# EAGLE design i2cLCD (EAGLE 6.1)
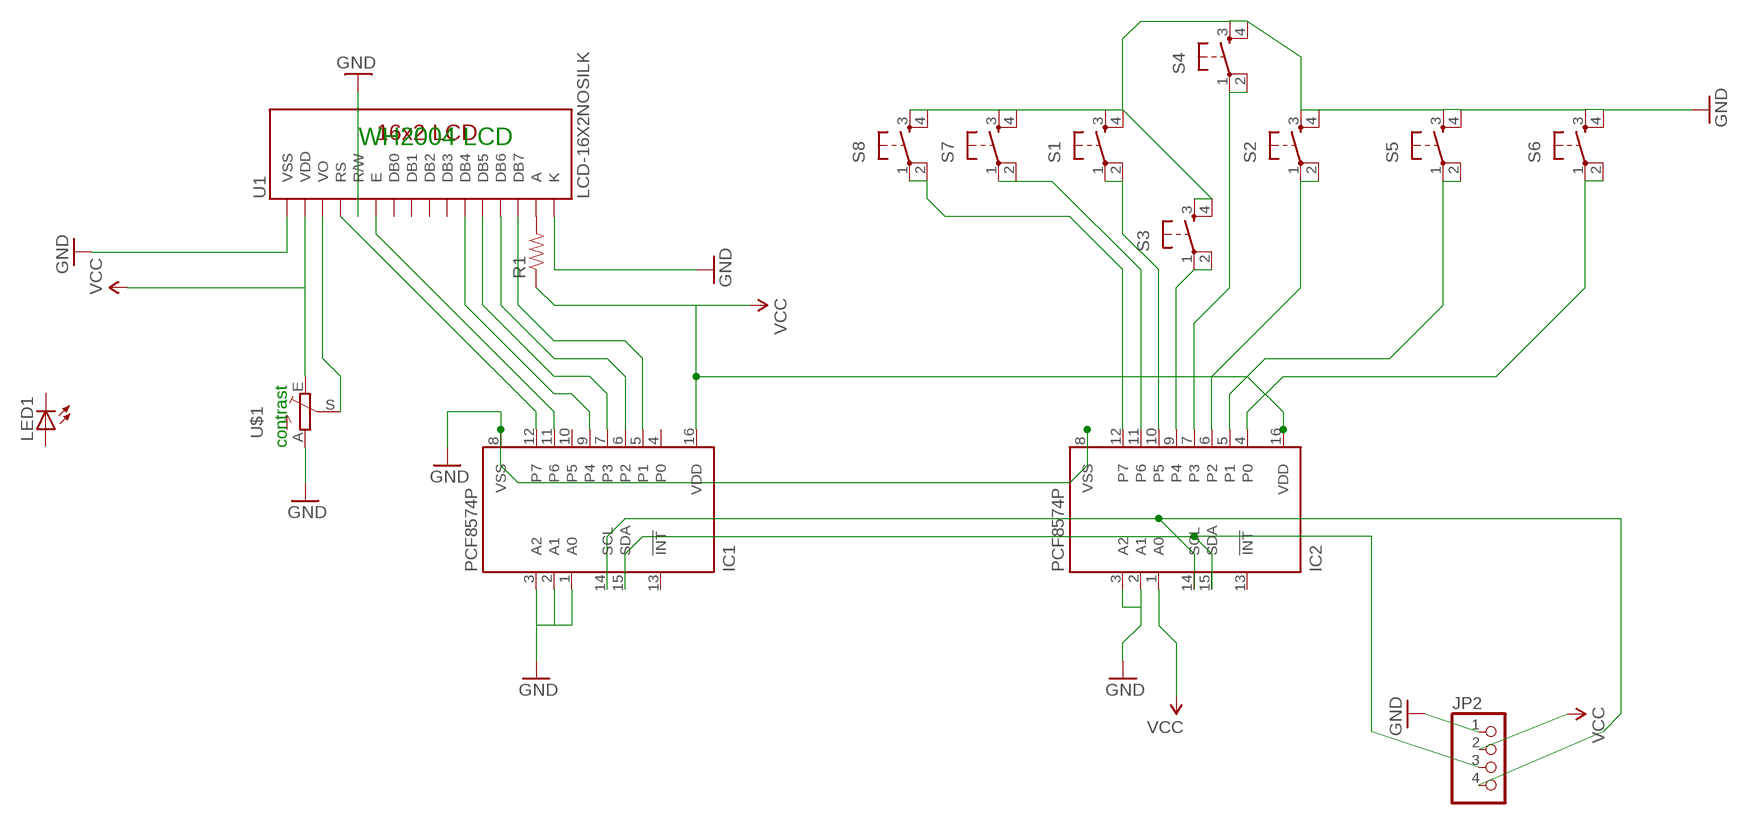
[diagram p0: schematic, sheet 1]

## Parts
IC1  PCF8574P  [DIL16]
IC2  PCF8574P  [DIL16]
JP2  PINHD-1X4/90  [1X04/90]
LED1  LED1206  [LED-1206]
R1  RESISTORPTH-1/4W  [AXIAL-0.4]
S1  TAC_SWITCHPTH  [TACTILE-PTH]
S2  TAC_SWITCHPTH  [TACTILE-PTH]
S3  TAC_SWITCHPTH  [TACTILE-PTH]
S4  TAC_SWITCHPTH  [TACTILE-PTH]
S5  TAC_SWITCHPTH  [TACTILE-PTH]
S6  TAC_SWITCHPTH  [TACTILE-PTH]
S7  TAC_SWITCHPTH  [TACTILE-PTH]
S8  TAC_SWITCHPTH  [TACTILE-PTH]
U1  LCD-16X2NOSILK  [LCD-16X2_NOSILK]
U$1  TRIM_EU-CA9V  [CA9V]

## Nets
N$1: U1.3(VO) U$1.S
N$2: R1.P$2 U1.15(A)
N$3: IC1.14(SCL) IC2.14(SCL) JP2.4
N$4: IC1.5(P1) U1.14(DB7)
N$5: IC1.6(P2) U1.13(DB6)
N$6: IC1.7(P3) U1.12(DB5)
N$7: IC1.9(P4) U1.11(DB4)
N$8: IC1.11(P6) U1.6(E)
N$9: IC1.12(P7) U1.4(RS)
N$10: IC1.15(SDA) IC2.15(SDA) JP2.3
N$13: IC2.10(P5) S1.1 S1.2
N$14: IC2.9(P4) S3.1 S3.2
N$15: IC2.7(P3) S4.1 S4.2
N$16: IC2.6(P2) S2.1 S2.2
N$17: IC2.5(P1) S5.1 S5.2
N$18: IC2.4(P0) S6.1 S6.2
N$19: IC2.11(P6) S7.1 S7.2
N$20: IC2.12(P7) S8.1 S8.2
N$31: IC1.1(A0) IC1.2(A1) IC1.3(A2) IC1.8(VSS) IC2.2(A1) IC2.3(A2) IC2.8(VSS) JP2.1 S1.3 S1.4 S2.3 S2.4 S3.3 S3.4 S4.3 S4.4 S5.3 S5.4 S6.3 S6.4 S7.3 S7.4 S8.3 S8.4 U1.1(VSS) U1.5(R/W) U1.16(K) U$1.A ; supply symbol labelled GND
VCC: IC1.16(VDD) IC2.1(A0) IC2.16(VDD) JP2.2 R1.P$1 U1.2(VDD) U$1.E
Unconnected: IC1.4(P0) IC1.10(P5) IC1.13(!INT) IC2.13(!INT) LED1.A LED1.C U1.7(DB0) U1.8(DB1) U1.9(DB2) U1.10(DB3)

## Notes on the sheet
- WH2004 LCD
- contrast

## Library data of the parts
IC1 IC2 = micro-philips:PCF8574: I2C-Bus Remote 8-bit I/O expander http://www.semiconductors.philips.com/acrobat_download/datasheets/PCF8574_4.pdf; MPN: PCF8574PN; OC_FARNELL: 204020; OC_NEWARK: 11N8515
JP2 = pinhead:PINHD-1X4: PIN HEADER
LED1 = LilyPad-Wearables:LED: LEDs Standard schematic elements and footprints for 5mm, 3mm, 1206, and 0603 sized LEDs. 5mm - Spark Fun Electronics SKU : Comp-SBL
R1 = SparkFun-Passives:RESISTOR: Resistor Basic schematic elements and footprints for 0603, 1206, and PTH resistors.
S1-S8 = SparkFun-Electromechanical:TAC_SWITCH: Momentary Switch Button commonly used for reset or general input. Spark Fun Electronics SKU : COM-00097
U1 = SparkFun-Displays:LCD-16X2: Standard text-only 16x2 parallel input LCD
U$1 = pot:TRIM_EU-: POTENTIOMETER

## Board
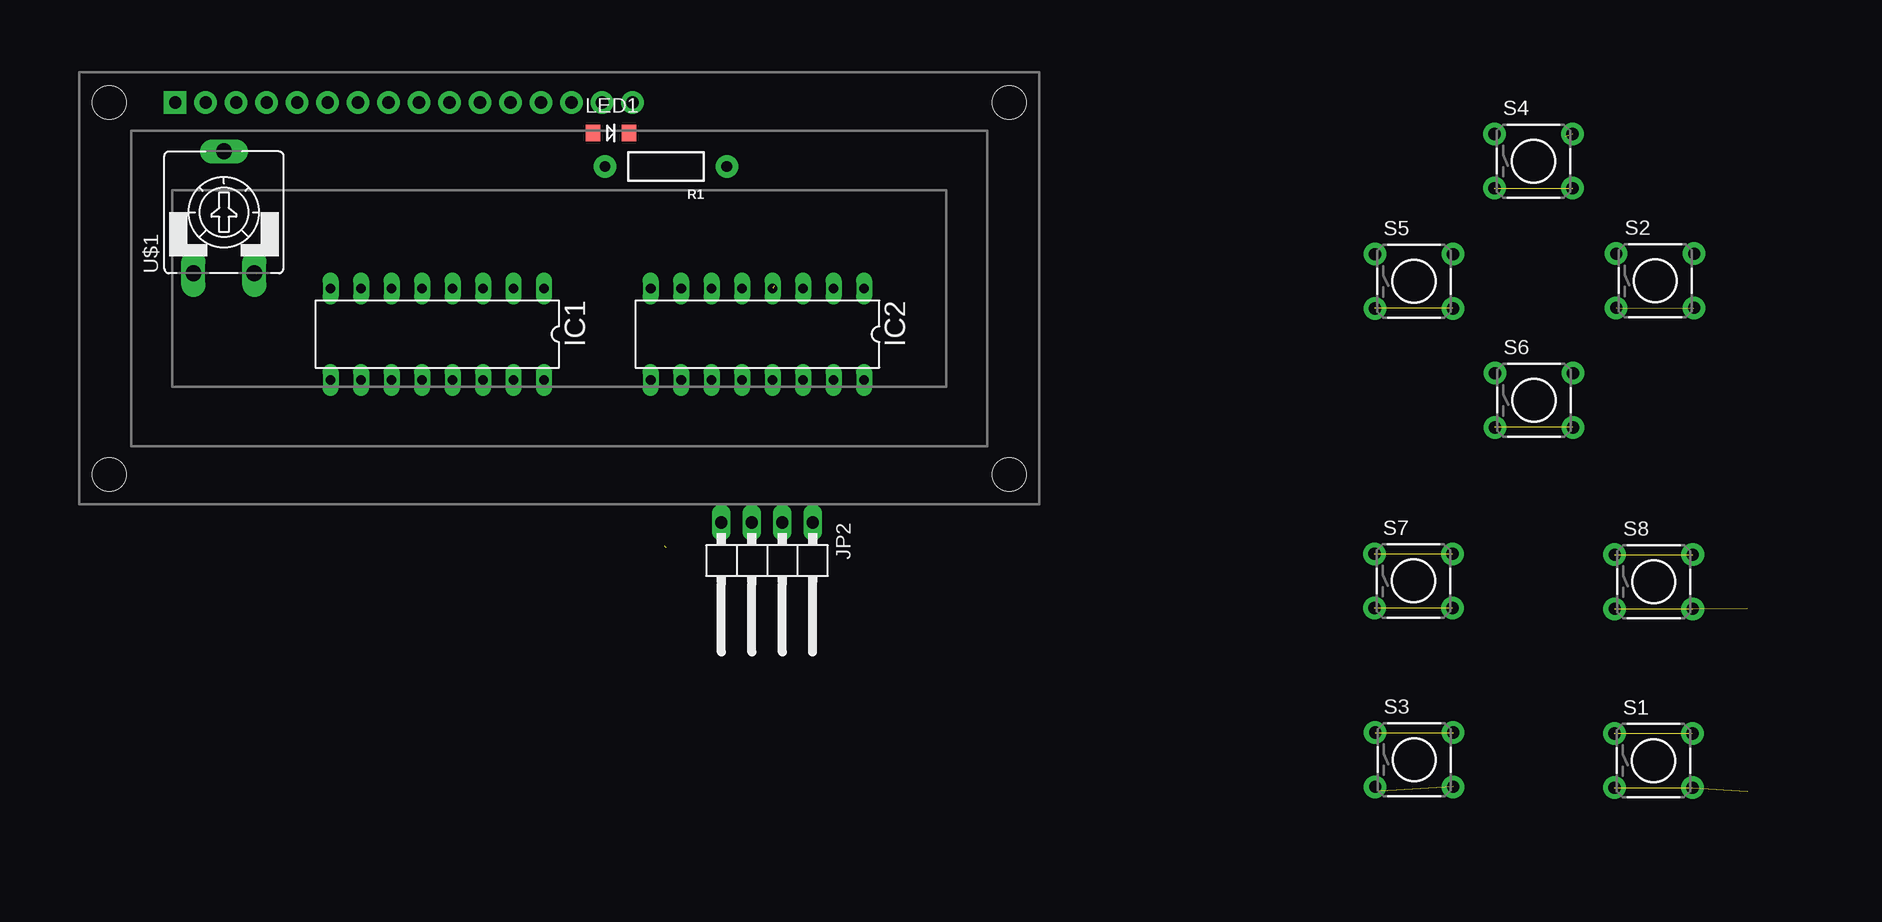
[diagram p1: board, top side]
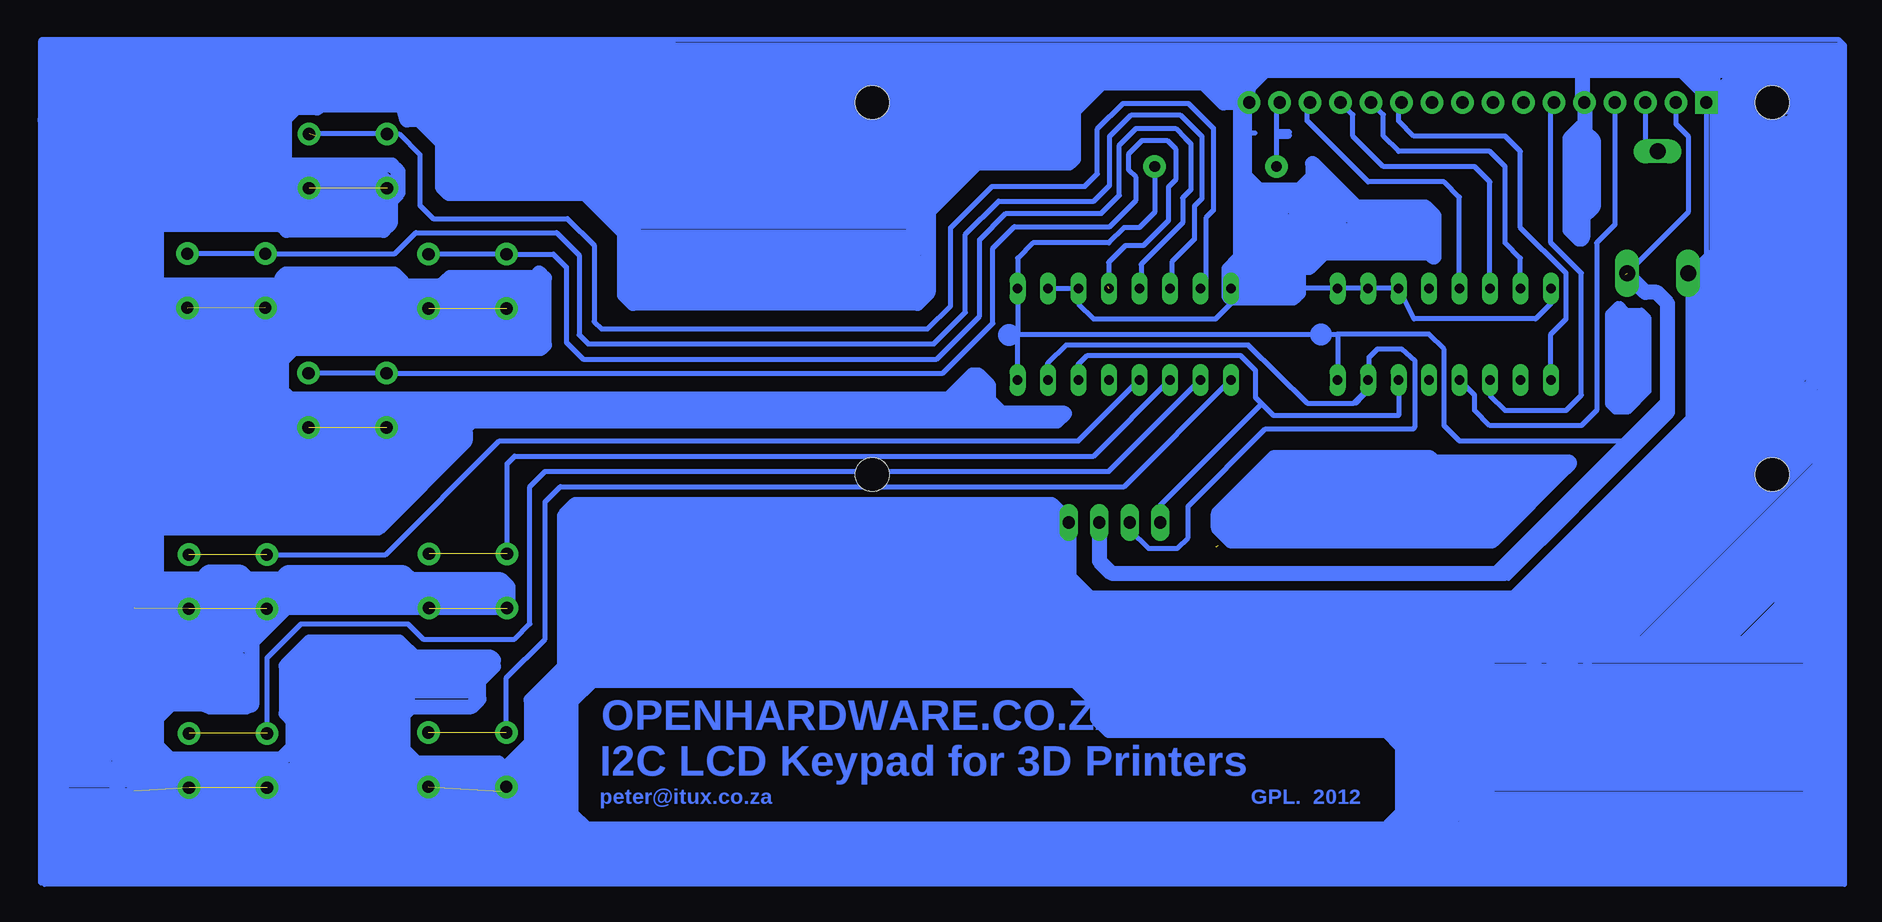
[diagram p2: board, bottom side, seen from below]

No outline drawn. Coordinates in mm, seen from the top.
Copper layers (1*16): Top 0.035mm / dielectric 1.5mm / Bottom 0.035mm
Design rules: minimum track width 10mil, minimum drill 24mil, track to track 8mil, track to pad 8mil, pad to pad 8mil, via to via 8mil, smd to smd 8mil, copper to edge 40mil, drill to drill 8mil, minimum pad ring 10mil, minimum via ring 8mil, stop-mask expansion 4mil, vias tented up to drill 0mil, thermal gap 10mil

### Footprints (pad centres in the part's own frame; a part is rotated, then mirrored left to right if it is on the bottom)
DIL16 = drill 0.813 long: 1 -8.89,-3.81; 2 -6.35,-3.81; 3 -3.81,-3.81; 4 -1.27,-3.81; 5 1.27,-3.81; 6 3.81,-3.81; 7 6.35,-3.81; 8 8.89,-3.81; 9 8.89,3.81; 10 6.35,3.81; 11 3.81,3.81; 12 1.27,3.81; 13 -1.27,3.81; 14 -3.81,3.81; 15 -6.35,3.81; 16 -8.89,3.81
1X04/90 = drill 1.016 long: 1 -3.81,-3.81; 2 -1.27,-3.81; 3 1.27,-3.81; 4 3.81,-3.81
LED-1206 = smd 1.2 x 1.4: A -1.5,0; C 1.5,0
AXIAL-0.4 = drill 0.9 pad 1.88: P$1 -5.08,0; P$2 5.08,0
TACTILE-PTH = drill 1.016 pad 1.88: 1 -3.251,2.261; 2 3.251,2.261; 3 -3.251,-2.261; 4 3.251,-2.261
LCD-16X2_NOSILK = drill 1.016 pad 1.88 square: 1 -32,15.5 | drill 1.016 pad 1.88: 2 -29.46,15.5; 3 -26.92,15.5; 4 -24.38,15.5; 5 -21.84,15.5; 6 -19.3,15.5; 7 -16.76,15.5; 8 -14.22,15.5; 9 -11.68,15.5; 10 -9.14,15.5; 11 -6.6,15.5; 12 -4.06,15.5; 13 -1.52,15.5; 14 1.02,15.5; 15 3.56,15.5; 16 6.1,15.5 | hole 2.8: -37.5,15.5; -37.5,-15.5; 37.5,15.5; 37.5,-15.5
CA9V = drill 1.321 long: A -2.54,-5.08; E 2.54,-5.08; S 0,5.08

### Placement (x,y rotation side)
IC1  31.75,40.64 180 top
IC2  58.42,40.64 180 top
JP2  59.23,21.13 180 top
LED1  46.21,57.41 0 top
R1  50.8,54.61 180 top
S1  133.1,5.11 0 top
S2  133.24,45.09 0 top
S3  113.16,5.18 0 top
S4  123.1,55.07 0 top
S5  113.14,45.05 0 top
S6  123.14,35.13 0 top
S7  113.1,20.08 0 top
S8  133.12,20.01 0 top
U1  41.91,44.45 0 top
U$1  13.97,50.8 0 top

### Tracks (layer width: path | path; a pad name or v marks a point on that pad's centre or on a via)
N$1
  Bottom 0.406: U1.3 14.99,56.9 U$1.S
N$2
  Bottom 0.406: R1.P$2 45.72,59.7 U1.15
N$3
  Bottom 0.406: IC1.14 35.56,33.88 45.99,33.88 46.95,34.83 | IC2.14 62.23,38.14 61.49,38.87 48.73,38.87 47.49,37.63 47.49,35.37 46.95,34.83 | JP2.4 55.41,24.95 55.41,26.37 46.95,34.83
N$4
  Bottom 0.406: IC1.5 30.48,52.07 31.75,53.34 38.1,53.34 43.18,58.42 43.18,59.7 U1.14
N$5
  Bottom 0.406: IC1.6 27.94,53.34 29.21,54.61 36.83,54.61 39.37,57.15 39.37,58.93 U1.13
N$6
  Bottom 0.406: IC1.7 25.4,46.99 26.67,48.26 26.67,54.61 27.94,55.88 35.56,55.88 36.83,57.15 36.83,58.93 U1.12
N$7
  Bottom 0.406: IC1.9 22.86,40.64 21.59,41.91 21.59,45.72 25.4,49.53 25.4,55.88 26.67,57.15 34.29,57.15 35.56,58.42 35.56,59.7 U1.11
N$8
  Bottom 0.406: IC1.11 27.94,35.56 26.67,34.29 21.59,34.29 20.32,35.56 20.32,45.72 22.86,48.26 22.86,59.7 U1.6
N$9
  Bottom 0.406: U1.4 17.53,49.78 19.05,48.26 19.05,34.29 20.32,33.02 27.94,33.02 29.21,34.29 29.21,35.56 IC1.12
N$10
  Bottom 0.406: IC1.15 38.1,36.03 39.11,34.9 39.28,34.9 | IC2.15 64.8,36.86 64.8,38.2 63.27,39.74 48.06,39.74 43.18,34.9 39.28,34.9 | 39.28,34.9 38,36.18 38,38.72 37.31,39.41 35.29,39.41 34.22,38.48 34.22,32.87 34.34,32.75 46.65,32.75 53.1,26.29 53.1,23.7 54.01,22.79 56.39,22.79 57.95,24.35 JP2.3
N$11
  Bottom 1.27: -0.25,59.93 -0.25,60.18 2.16,62.58 95.84,62.58 97.42,64.16 -0.58,64.16 -0.66,64.08 -0.66,-4.32 -0.5,-4.48 106.27,-4.48
N$12
  Bottom 1.27: -0.58,61.45 0.41,61.45 2.49,63.53
N$13  (1 unrouted)
  Bottom 0.406: S1.1 129.85,13.66 127,16.51 118.11,16.51 116.84,15.24 109.22,15.24 107.95,16.51 107.95,27.94 106.68,29.21 59.69,29.21 IC2.10
N$14  (1 unrouted)
  Bottom 0.406: S3.1 109.91,12.01 106.68,15.24 106.68,26.67 105.41,27.94 58.42,27.94 IC2.9
N$15  (1 unrouted)
  Bottom 0.406: 125.73,57.15 125.55,57.33 S4.1 118.84,57.33 117.11,55.6 117.11,51.38 116,50.27 104.81,50.27 102.6,48.06 102.6,41.7 101.98,41.07 74.83,41.07 72.89,43.01 72.89,49.51 69.44,52.97 61.7,52.97 60.66,54.01 60.66,57.74 58.52,59.88 53.06,59.88 50.99,57.81 50.99,50.96 51.61,50.34 51.61,44.91 IC2.7
N$16
  Bottom 0.406: S2.2 S2.1 119.2,47.35 117.45,49.1 105.71,49.1 103.84,47.23 103.84,40.59 103.08,39.83 74.27,39.83 71.65,42.46 71.65,48.96 68.88,51.72 60.94,51.72 59.62,53.04 59.62,57.12 57.83,58.91 53.75,58.91 51.96,57.12 51.96,51.93 52.58,51.31 52.58,48.54 54.44,46.68 54.44,44.62 IC2.6
N$17
  Bottom 0.406: 116.05,47.65 S5.2 S5.1 105.98,47.31 104.9,46.23 104.9,39.95 103.51,38.55 74.05,38.55 70.47,42.14 70.47,48.52 68.28,50.71 60.32,50.71 58.82,52.2 58.82,56.39 57.43,57.78 54.14,57.78 53.35,56.99 53.34,56.99 52.85,56.49 52.85,52.69 53.55,52 53.55,49.92 57,46.47 57,44.6 IC2.5
N$18  (1 unrouted)
  Bottom 0.406: S6.2 S6.1 73.52,37.39 69.37,41.54 69.37,47.82 67.58,49.61 59.62,49.61 57.43,51.8 57.43,53.7 58.02,54.3 58.02,55.69 56.93,56.79 54.84,56.79 54.14,56.09 54.14,53.5 54.74,52.9 54.74,50.11 56.83,48.02 58.32,48.02 59.72,46.62 59.72,44.73 59.82,44.63
N$19  (1 unrouted)
  Bottom 0.406: S7.1 109.85,29.85 109.22,30.48 60.96,30.48 IC2.11
N$20  (1 unrouted)
  Bottom 0.406: S8.1 119.97,22.27 110.49,31.75 62.23,31.75 IC2.12
N$21
  Bottom 1.27: 0.08,63.03 1.16,63.03 1.57,63.44
N$22
  Bottom 1.27: 0.08,62.36 1.82,62.36 2.9,63.44 96.18,63.44 96.26,63.53
N$23
  Bottom 1.27: 6.68,62.86 6.79,62.86 9.5,60.15 10.19,60.15 10.19,61.82 11.05,62.69
N$24
  Bottom 1.27: 9.38,62.34 9.38,61.65 9.27,61.54
N$25
  Bottom 1.27: 20.21,59.98 20.21,62.52 20.09,62.63
N$26
  Bottom 1.27: 48.08,59.92 48.08,60.15 48.08,61.13 | 48.08,61.13 48.08,61.25 46.69,62.63 | 48.08,61.13 49.63,62.69
N$27
  Bottom 1.27: 12.52,63 12.27,63 10.12,60.84 0.33,60.84 0.17,60.67 | 0.17,60.67 | 0.17,60.67 0.83,61.34 6.8,61.34 7.21,61.75 7.05,61.75 6.72,62.09 1.24,62.09 1.08,61.92 1.08,60.92 -0.58,59.26
N$28
  Bottom 1.27: 85.93,63.05 94.39,63.05 94.83,62.6 95.12,62.6 95.14,62.59 97.89,62.59 97.9,62.6 97.9,64.26 97.81,64.35
N$29
  Bottom 1.27: 8.91,61.13 8.91,59.61 9.05,59.47 9.05,47.37 10.78,45.64 10.78,33.6 21.35,23.03
N$30
  Bottom 1.27: 22.12,25.17 13.13,34.16 13.13,43.22 14.03,44.12 14.99,44.12 16.37,45.5
N$31  (10 unrouted)
  Bottom 0.406: U1.1 9.91,47.24 U$1.A 11.43,33.02 21.59,22.86 21.59,22.34 | U1.5 20.07,61.21 20.32,62.23 | 20.32,62.23 11.43,62.23 10.16,60.96 10.16,60.2 U1.1 | IC1.3 IC1.2 IC1.1 | U1.16 48.01,45.97 48.02,45.82 | IC1.8 22.86,43.18 24.13,41.91 34.29,41.91 IC1.3 | IC1.3 IC1.1 | IC1.1 IC2.8 | IC2.8 48.02,45.82 | 48.02,45.82 48.02,61.06 46.99,62.23 20.32,62.23 | IC2.2 IC2.3 62.23,43.18 60.96,41.91 50.8,41.91 49.53,43.18 IC2.8 | 106.68,-3.81 0,-3.81 0,35.28 0,59.69 | 0,59.69 2.54,62.23 7.63,62.23 U1.1 | 0,59.69 0,62.23 95.25,62.23 97.79,64.77 -1.27,64.77 -1.27,-5.08 106.68,-5.08 106.68,-3.81 | S5.3 136.44,42.78 | 136.44,42.78 S2.4 | S4.3 140.23,52.81 140.97,52.07 140.97,43.18 | 140.97,43.18 140.97,33.02 | 140.97,33.02 140.97,17.78 | 140.97,17.78 140.97,2.54 110.29,2.54 | 110.29,2.54 S3.3 | S7.3 140.93,17.82 140.97,17.78 | S6.3 140.82,32.87 140.97,33.02 | 136.44,42.78 140.57,42.78 140.97,43.18 | 110.29,2.54 110.29,-2.74 109.22,-3.81 106.68,-3.81
  Bottom 1.27: 8,61.7 8,46.75 9.79,44.96 9.79,33.96 10.39,33.36 -0.24,33.36 -0.48,33.6 -0.36,33.6 0.6,34.56 8.48,34.56 8.84,34.2 8.84,35.46 | 8.84,35.46 8.84,44.97 6.81,46.99 6.81,60.99 6.45,61.34 6.45,61.1 5.61,60.27 5.61,46.87 8.12,44.37 8.12,35.75 7.76,35.4 0.12,35.4 0,35.28 0,58.6 1.79,60.39 4.54,60.39 4.9,60.03 4.9,46.27 7.41,43.77 7.41,36.71 6.81,36.11 1.43,36.11 0.95,36.59 0.95,58.12 2.39,59.55 3.7,59.55 3.94,59.31 3.94,45.56 6.57,42.93 6.57,37.19 2.15,37.19 2.03,37.31 2.03,57.52 2.87,58.36 2.87,55.84 2.63,55.6 2.63,38.98 3.46,38.15 5.85,38.15 6.09,38.39 6.09,42.34 3.1,45.32 3.1,38.27 2.87,38.03 3.46,38.03 4.42,38.98 4.42,43.29 4.18,43.53 4.18,42.57 5.37,41.38 5.37,39.22 5.49,39.1 5.49,38.86 5.37,38.74 | JP2.1 63.04,20.39 60.75,18.1 26.2,18.1 8.84,35.46
N$32
  Bottom 1.27: 32.59,47.07 32.59,50.47 33.34,51.22 39.09,51.22 42.72,54.85 42.72,53.7 43.87,52.55 45.6,52.55 46.29,51.86 46.29,46.73 45.77,46.21 43.01,46.21 41.8,47.42 32.99,47.42 32.65,47.07 32.65,47.53 33.28,48.17 42.6,48.17 43.64,47.13 45.31,47.13 45.37,47.19 45.37,50.99 45.02,51.34 43.76,51.34 42.09,53.01 39.55,50.47 33.57,50.47 33.22,50.13 33.22,49.49 33.45,49.26 42.49,49.26 43.76,48 44.1,48 44.33,47.77 44.33,50.01 44.45,50.13 43.87,50.13 42.38,51.62 42.03,51.62 40.53,50.13 41.68,50.13 42.03,50.47 42.78,50.47 43.87,49.38 43.7,49.38 43.41,49.09
N$33
  Bottom 1.27: 20.04,59.81 20.04,57.53 19.34,56.84 19.34,51.24 20.31,50.27 20.31,48.82 20.24,48.75 20.24,48.96 21.07,49.79 21.07,56.98 20.38,57.67 20.38,56.29 20.04,55.94 20.04,51.72 20.86,50.89
N$34
  Bottom 1.27: 20.05,51.5 20.05,50.58 20.21,50.41 20.21,48.7 20.33,48.59 20.52,48.59 21.26,49.33 21.26,56.96 20.24,57.98
N$35
  Bottom 0.406: -1.6,-5.2 148.4,-5.2
N$36
  Bottom 0.406: -1.6,-5.2 -1.6,64.7 -1.1,65.2 148.6,65.2 148.7,65.1 148.7,-5.1 101.1,-5.1
N$37
  Bottom 1.27: 109.72,2.88 140.78,2.88
N$38
  Bottom 1.27: 109.84,17.84 140.9,17.84 140.98,17.92
N$39
  Bottom 1.27: 119.68,32.88 141.98,32.88 142.06,32.95
N$40
  Bottom 1.27: 109.84,42.79 141.82,42.79 141.9,42.87
N$41
  Bottom 1.27: 139.06,-3.07 139.06,49.58 135.99,52.65 119.9,52.65 119.73,52.82
N$42
  Bottom 1.27: 106.04,-4.42 109.74,-4.42 110.7,-3.47 110.7,2.03
N$43
  Bottom 1.27: 108.79,-4.54 148.12,-4.54 148.13,-4.56 148.13,64.66 148.09,64.7 125.87,64.7 125.35,64.18 125.35,59.82 125.67,59.5 127.51,59.5 128.43,58.58 128.43,52.9 128.47,52.86
N$44
  Bottom 1.27: 128.91,53.14 128.91,59.42 128.15,60.18 | 126.87,63.06 127.19,62.74 147.33,62.74 147.33,63.66 147.21,63.78 126.27,63.78 126.35,63.7 126.35,60.42 126.39,60.38 127.95,60.38 128.15,60.18 | 147.09,60.18 128.15,60.18
N$45
  Bottom 1.27: 126.91,62.42 146.81,62.42 147.77,61.46
N$46
  Bottom 1.27: 147.61,61.58 125.99,61.58 125.47,62.1
N$47
  Bottom 1.27: 126.79,61.26 146.45,61.26 147.17,60.54
N$48
  Bottom 1.27: 128.71,59.06 147.33,59.06 147.61,59.34
N$49
  Bottom 1.27: 128.87,58.34 148.17,58.34 148.33,58.5
N$50
  Bottom 1.27: 129.47,57.16 147.37,57.16 147.43,57.1
N$51
  Bottom 1.27: 129.41,56.23 146.96,56.23 147.31,55.89
N$52
  Bottom 1.27: 111.36,1.91 140.8,1.91
N$53
  Bottom 1.27: 110.95,1.08 140.38,1.08 140.88,0.58
N$54
  Bottom 1.27: 111.03,0.17 140.55,0.17 140.72,0
N$55
  Bottom 1.27: 111.03,-0.83 141.05,-0.83 141.21,-0.66
N$56
  Bottom 1.27: 111.28,-1.41 140.72,-1.41 140.8,-1.49
N$57
  Bottom 1.27: 111.36,-2.24 140.47,-2.24 140.63,-2.41
N$58
  Bottom 1.27: 111.03,-3.24 141.38,-3.24 141.46,-3.32
N$59
  Bottom 1.27: 112.77,-3.98 146.77,-3.98 147.18,-3.57
N$60
  Bottom 1.27: 141.46,-2.82 147.35,-2.82 147.51,-2.99
N$61
  Bottom 1.27: 140.55,-1.91 147.02,-1.91 147.43,-1.49
N$62
  Bottom 1.27: 140.22,-1 147.6,-1 147.68,-0.91
N$63
  Bottom 1.27: 141.54,0 147.43,0
N$64
  Bottom 1.27: 140.47,0.83 147.43,0.83 147.51,0.91
N$65
  Bottom 1.27: 140.47,2.16 147.26,2.16 147.6,1.83
N$66
  Bottom 1.27: 140.05,3.48 147.35,3.48 147.68,3.15
N$67
  Bottom 1.27: 139.47,4.4 147.51,4.4 147.85,4.07
N$68
  Bottom 1.27: 140.79,1.1 146.26,1.1 146.86,1.69
N$69
  Bottom 1.27: 113.63,-4.08 111.24,-4.08 111.14,-3.98
N$70
  Bottom 1.27: 139.7,56.58 139.7,3.88 140.89,2.69
N$71
  Bottom 1.27: 140.49,3.39 140.49,56.98 141.69,58.17
N$72
  Bottom 1.27: 142.19,55.88 142.19,3.49 142.48,3.19
N$73
  Bottom 1.27: 142.28,3.09 142.28,3.19 141.19,4.28 141.19,55.39 140.99,55.59
N$74
  Bottom 1.27: 138.6,56.08 138.6,50.6 139.1,50.11
N$75
  Bottom 1.27: 138.9,51.2 138.9,51.41 136.31,53.99 136.81,53.99 137.11,53.69 129.95,53.69 129.85,53.59
N$76
  Bottom 1.27: 129.75,53.89 129.75,55.59 | 129.75,55.59 129.75,55.78 130.05,56.08 | 129.75,55.59 141.09,55.59 141.19,55.69
N$77
  Bottom 1.27: 130.64,54.59 139.6,54.59 139.9,54.29
N$78
  Bottom 1.27: 137.01,53.39 138.8,53.39 139.1,53.69
N$79
  Bottom 1.27: 143.28,55.59 143.28,5.48 144.37,4.38
N$80
  Bottom 1.27: 144.87,4.08 144.87,55.88 145.37,56.38
N$81
  Bottom 1.27: 143.48,56.48 143.48,6.37 144.28,5.58 144.28,55.88 144.47,56.08
N$82
  Bottom 1.27: 145.87,55.98 145.87,4.18 146.76,3.29
N$83
  Bottom 1.27: 147.06,4.28 147.06,56.28 145.77,57.58
N$84
  Bottom 1.27: 146.66,56.98 146.66,4.88 145.87,4.08
N$85
  Bottom 1.27: 119.59,52.65 119.59,49.86 120.17,49.29 128.22,49.29 128.7,49.77 138.92,49.77 138.97,49.72
N$86
  Bottom 1.27: 137.72,50.3 120.36,50.3 119.97,50.68 119.97,51.16 120.31,51.5 140.74,51.5 141.37,50.87
N$87
  Bottom 1.27: 117.09,42.86 118.15,42.86 118.53,43.24 118.53,44.92 119.25,45.64 128.27,45.64 128.61,45.3 128.61,43.48 128.99,43.1
N$88
  Bottom 1.27: 128.32,43.05 128.32,43.77 127.7,44.39 119.73,44.39
N$89
  Bottom 1.27: 119.35,43.58 127.46,43.58 127.5,43.53
N$90
  Bottom 1.27: 128.13,32.78 128.13,35.42 128.61,35.9 128.61,38.49 127.65,39.45 113.74,39.45
N$91
  Bottom 1.27: 116.72,39.84 114.29,39.84 113.9,39.45 107.05,39.45 106.74,39.76 106.74,45.31 107.19,45.75
N$92
  Bottom 1.27: 110.72,41.9 110.43,42.19
N$93
  Bottom 1.27: 111,42.14 138.73,42.14 138.78,42.09
N$94
  Bottom 1.27: 110.67,41.18 140.17,41.18 140.36,40.99
N$95
  Bottom 1.27: 112.01,39.55 112.01,40.55 111.96,40.6
N$96
  Bottom 1.27: 111.87,40.12 141.56,40.12 141.61,40.07
N$97
  Bottom 1.27: 128.75,39.26 128.75,33.88 128.99,33.64
N$98
  Bottom 1.27: 129.66,39.26 129.66,34.03 130.09,33.59
N$99
  Bottom 1.27: 130.43,39.88 130.43,34.55 131.25,33.74
N$100
  Bottom 1.27: 131.15,33.74 139.69,33.74 140.03,34.08
N$101
  Bottom 1.27: 130.72,34.99 140.17,34.99 140.5,34.65
N$102
  Bottom 1.27: 130.77,35.99 139.74,35.99 140.55,35.18
N$103
  Bottom 1.27: 131.15,36.86 139.78,36.86 141.03,35.61
N$104
  Bottom 1.27: 130.72,37.58 138.15,37.58 138.3,37.43
N$105
  Bottom 1.27: 131.49,38.39 140.31,38.39 140.41,38.49
N$106
  Bottom 1.27: 131.01,39.4 139.31,39.4 140.12,38.59
N$107
  Bottom 1.27: 126.99,44.71 140.8,44.71 141.38,44.13
N$108
  Bottom 1.27: 128.54,43.62 137.69,43.62 138.96,42.35
N$109
  Bottom 1.27: 129.87,44.08 141.78,44.08
N$110
  Bottom 1.27: 110.41,42.92 110.41,43.16 111.91,44.65 127.16,44.65 127.62,44.19
N$111
  Bottom 1.27: 112.08,43.79 118.58,43.79 118.7,43.67
N$112
  Bottom 1.27: 119.56,50.42 119.56,51.8 118.93,52.43 118.93,54.22 119.44,54.74 129.92,54.74 129.98,54.68
N$113
  Bottom 1.27: 120.08,53.53 129.17,53.53 130.32,52.38
N$114
  Bottom 1.27: 113.35,32.55 113.35,32.9 115.42,34.97 136.43,34.97 136.49,34.92
N$115
  Bottom 1.27: 113.35,32.5 113.35,31.74 120.6,24.49 139.43,24.49 139.48,24.43
N$116
  Bottom 1.27: 120.95,25.12 141.38,25.12
N$117
  Bottom 1.27: 120.26,26.1 139.54,26.1 139.66,25.99
N$118
  Bottom 1.27: 119.62,26.73 141.5,26.73 141.84,27.08
N$119
  Bottom 1.27: 118.76,27.31 141.56,27.31 141.79,27.54
N$120
  Bottom 1.27: 117.95,28.06 140.98,28.06 141.44,28.52
N$121
  Bottom 1.27: 116.92,28.81 139.19,28.81 139.25,28.75
N$122
  Bottom 1.27: 116.4,29.62 139.37,29.62
N$123
  Bottom 1.27: 115.71,30.31 140.75,30.31
N$124
  Bottom 1.27: 115.19,31.11 140.4,31.11
N$125
  Bottom 1.27: 114.5,31.75 138.33,31.75 139.37,30.71
N$126
  Bottom 1.27: 113.46,32.09 120.2,32.09 121.12,33.02
N$127
  Bottom 1.27: 114.33,33.02 124.46,33.02 124.52,32.96
N$128
  Bottom 1.27: 115.65,33.94 130.1,33.94 130.91,33.13
N$129
  Bottom 1.27: 109.77,17.96 109.77,19.56 110.36,20.16 117.84,20.16 118.44,20.76 128.19,20.76 128.71,20.24 131.47,20.24 132.03,20.8 134.79,20.8 135.35,20.24 140.54,20.24 140.58,20.28
N$130
  Bottom 1.27: 140.02,19.16 110.84,19.16 110.76,19.08
N$131
  Bottom 1.27: 110.72,18.72 138.06,18.72 138.43,18.36
N$132
  Bottom 1.27: 118.6,19.92 128.59,19.92
N$133
  Bottom 1.27: 133.27,19.48 132.35,19.48 132.11,19.72 132.27,19.72 132.31,19.76 134.71,19.76 134.83,19.64
N$134
  Bottom 1.27: 128.09,18.33 128.09,18.05 131.13,15.01 131.13,9.75 131.62,9.55 134.59,9.55 135.28,9.82 137.9,9.82 139.01,8.71
N$135
  Bottom 1.27: 131.89,10.17 139.22,10.17 139.29,10.1
N$136
  Bottom 1.27: 131.62,11.2 144.81,11.2 145.09,10.93
N$137
  Bottom 1.27: 131.34,12.1 138.53,12.1 138.66,12.24
N$138
  Bottom 1.27: 132.03,13.49 140.32,13.49 140.53,13.28
N$139
  Bottom 1.27: 132.03,12.86 139.84,12.86 139.91,12.79
N$140
  Bottom 1.27: 131.89,14.73 138.59,14.73 139.08,14.25
N$141
  Bottom 1.27: 131.2,15.77 138.87,15.77 139.08,15.56
N$142
  Bottom 1.27: 130.1,16.74 139.08,16.74 139.63,16.18
N$143
  Bottom 1.27: 111.04,13.63 117.52,13.63 118.86,14.98 126.3,14.98 128.26,13.01 128.26,9.02 127.69,8.45 127.69,6.19 128.65,5.23 137.95,5.23 139.1,6.38
N$144
  Bottom 1.27: 138.96,4.27 127.98,4.27 127.93,4.22
N$145
  Bottom 1.27: 118.91,2.3 125.24,2.3 126.83,3.89 139.2,3.89 139.54,3.55
N$146
  Bottom 1.27: 110.28,2.78 110.28,4.61 110.56,4.9 117.42,4.9 118.48,5.95 118.48,8.98 117.86,9.6 112.82,9.6 112.19,10.22 112.19,11.76 111,12.96 111,13.49 111.19,13.68
N$147
  Bottom 1.27: 111.32,13.73 120.61,13.73 120.75,13.86
N$148
  Bottom 1.27: 112.09,12.7 121.91,12.7 122.68,12.7 127.31,12.7 127.44,12.83
N$149
  Bottom 1.27: 120.91,13.8 126.44,13.8 126.54,13.7
N$150
  Bottom 1.27: 127.38,12.4 127.38,4.1 127.54,3.93
N$151
  Bottom 1.27: 125.74,13.1 125.74,3.2 125.58,3.03
N$152
  Bottom 1.27: 126.48,12.3 126.48,3.73 126.54,3.67
N$153
  Bottom 1.27: 125.64,3.6 111.52,3.6 111.25,3.87
N$154
  Bottom 1.27: 111.49,3.83 117.58,3.83 119.28,5.53 119.28,11.2 119.22,11.26
N$155
  Bottom 1.27: 112.59,11.9 124.71,11.9 124.78,11.83
N$156
  Bottom 1.27: 112.85,10.9 125.04,10.9 125.41,11.26
N$157
  Bottom 1.27: 118.05,9.93 119.98,9.93
N$158
  Bottom 1.27: 120.25,9.8 127.01,9.8 127.04,9.83
N$159
  Bottom 1.27: 120.15,9 120.15,4.87 119.35,4.07
N$160
  Bottom 1.27: 119.72,4.5 125.41,4.5 125.51,4.6
N$161
  Bottom 1.27: 120.41,5.3 125.48,5.3 125.51,5.33
N$162
  Bottom 1.27: 120.71,5.9 125.38,5.9 125.54,6.07
N$163
  Bottom 1.27: 120.98,6.6 125.48,6.6 126.01,7.13
N$164
  Bottom 1.27: 120.98,7.4 125.64,7.4 125.68,7.43
N$165
  Bottom 1.27: 121.35,8.2 125.04,8.2 125.08,8.16
N$166
  Bottom 1.27: 120.65,8.66 125.08,8.66 125.54,9.13
N$167
  Bottom 1.27: 107.55,45.36 114.61,45.36 115.31,44.73
N$168
  Bottom 1.27: 108.26,52.52 114.82,52.52 115.22,52.92 115.22,56.62 117.11,58.51 118.21,58.51 118.55,59.7 126.21,59.7 127.16,59.8
N$169
  Bottom 1.27: 125.87,60 125.95,60 126.82,59.84 128.11,59.2
N$170
  Bottom 1.27: 125.63,59.96 118.08,59.96 117.44,59.32 116.12,59.32 115.36,58.56 115.36,58.24 114,56.88 114,54.24 114.48,53.76
N$171
  Bottom 1.27: 114.16,53.56 109.89,53.56 109.64,53.8 109,53.8 108.69,53.48 107.81,53.48 107.65,53.32 107.65,53 107.89,52.76
N$172
  Bottom 1.27: 107.93,53 107.93,63.12 109.53,64.72 127.31,64.72
N$173
  Bottom 1.27: 127.63,64.64 96.33,64.64 95.89,64.2
N$174
  Bottom 1.27: 95.02,62.52 126.55,62.52 126.99,62.08
N$175
  Bottom 1.27: 95.42,63.64 124.79,63.64 124.99,63.44
N$176
  Bottom 1.27: 79.83,63.12 83.34,63.12 84.9,61.56 124.52,61.56 124.59,61.64
N$177
  Bottom 1.27: 125.47,61 108.81,61 108.53,61.28
N$178
  Bottom 1.27: 108.92,61.44 108.92,54.68 109.17,54.44
N$179
  Bottom 1.27: 109.17,54.4 113.16,54.4
N$180
  Bottom 1.27: 109.44,55.4 113.12,55.4 113.2,55.32
N$181
  Bottom 1.27: 109.17,56.56 112.88,56.56 112.96,56.48
N$182
  Bottom 1.27: 109.81,57.56 114.56,57.56 114.64,57.64
N$183
  Bottom 1.27: 108.77,58.4 114.68,58.4 115.28,59
N$184
  Bottom 1.27: 109.61,59.2 116.4,59.2 117.16,59.96
N$185
  Bottom 1.27: 117.64,60.12 110.32,60.12 110.16,60.28
N$186
  Bottom 1.27: 109.89,60.04 109.36,60.04 108.97,59.64
N$187
  Bottom 1.27: 107.09,61.24 107.09,53.48 108.05,52.52
N$188
  Bottom 1.27: 107.24,45.12 107.24,40.45 107.38,40.31 111.54,40.31 111.71,40.48
N$189
  Bottom 1.27: 48.21,59.92 50.12,59.92 51.77,61.56 61.64,61.56 61.96,61.88 | 57.9,63.41 58.52,63.41 62.66,59.26 62.66,55.25 63.01,54.9 70.75,54.9 74.76,50.89 74.76,44.12 75.65,43.22 99.35,43.22 100.04,43.91 100.04,49.1 103.29,52.35 114.67,52.35 115.24,52.92 102.73,52.92 99.37,49.56 99.37,44.6 98.85,44.08 75.79,44.08 75.15,44.72 75.15,45.12 75.19,45.16 98.49,45.16 98.53,45.12 98.53,45.6 98.77,45.84 75.79,45.84 75.07,46.56 98.17,46.56 99.21,47.6 75.91,47.6 75.15,48.36 98.85,48.36 99.25,48.76 76.35,48.76 75.11,50 98.85,50 102.25,53.4 106.01,53.4 106.45,53.84 105.69,53.84 105.57,53.72 101.33,53.72 98.61,51 75.47,51 75.39,51.08 75.15,51.08 74.31,51.92 99.89,51.92 99.97,52 99.97,52.44 74.15,52.44 72.79,53.8 100.65,53.8 100.69,53.84 100.69,53.36 100.85,53.2 73.27,53.2 71.95,54.52 107.13,54.52 107.69,55.08 107.69,55.2 107.81,55.32 63.48,55.32 62.96,55.84 62.96,56.04 63,56.08 106.57,56.08 107.17,56.68 106.65,56.68 106.41,56.92 64.32,56.92 63.68,57.56 63.68,57.12 63.48,56.92 63.48,59.52 61.12,61.88 61.96,61.88 | 61.96,61.88 91.3,61.88 91.54,61.64 63.36,61.64 62.76,61.04 99.69,61.04 101.05,59.68 62.96,59.68 62.68,59.96 63.04,59.96 63.16,60.08 104.73,60.08 104.81,60.16 106.81,60.16 107.21,60.56 101.05,60.56 100.89,60.72 100.89,59.64 100.65,59.4 106.53,59.4 106.65,59.28 106.65,58.68 106.53,58.56 64.04,58.56 63.84,58.76 63.84,57.88 106.13,57.88 106.17,57.92
N$190
  Bottom 1.27: 52.28,62.2 50.37,62.2 48.81,60.64
N$191
  Bottom 1.27: 48.89,60.56 49.69,60.56 51.12,62
N$192
  Bottom 1.27: 48.73,60.09 48.73,45.55 49.55,44.73
N$193
  Bottom 1.27: 45.25,52.48 47.05,52.48 | 47.05,52.48 47.12,52.48 47.95,53.31 | 48.57,53.73 48.3,53.73 47.05,52.48
N$194
  Bottom 1.27: 42.35,52.83 43.29,52.83 43.35,52.89
N$195
  Bottom 1.27: 44.24,52.03 45.02,52.03 45.57,52.58 48.38,52.58
N$196
  Bottom 1.27: 48.21,52.69 43.71,52.69
N$197
  Bottom 1.27: 43.77,52.14 47.38,52.14 48.07,51.45
N$198
  Bottom 1.27: 47.96,51.14 47.96,46.2 48.01,46.14
N$199
  Bottom 1.27: 44.02,46.64 45.1,46.64 45.54,46.2 47.6,46.2 47.63,46.23 47.63,45.28 48.85,44.06 | 48.85,44.06 | 48.85,44.06 49.21,43.7
N$200
  Bottom 1.27: 47.9,45.28 47.9,50.36 46.96,51.31 46.96,47.06 47.38,46.64
N$201
  Bottom 1.27: 43.91,47.48 43.91,44.09 44.35,43.64 49.51,43.64 49.68,43.81 49.68,46.06 48.9,46.84
N$202
  Bottom 1.27: 47.63,44.78 44.24,44.78 44.18,44.84 44.18,45.23 44.32,45.37 47.63,45.37 47.65,45.39
N$203
  Bottom 1.27: 109.76,42.62 109.8,42.66
N$204
  Bottom 1.27: 107.85,41.28 110.68,41.28 110.74,41.23
N$205
  Bottom 1.27: 107.6,42.26 109.91,42.26 110.02,42.14
N$206
  Bottom 1.27: 107.27,43.23 109.91,43.23 109.96,43.28
N$207
  Bottom 1.27: 107.94,44.12 111.1,44.12
N$208
  Bottom 1.27: 108.16,44.92 111.38,44.92 111.79,44.5
N$209
  Bottom 1.27: 70.53,37.16 70.59,37.16 72.55,35.2 128.74,35.2 129.66,34.28
N$210
  Bottom 1.27: 115.09,31.52 114.63,31.52 112.73,33.42 64.02,33.42 63.39,34.05 68.69,34.05 69.72,35.09 69.72,36.36 70.59,37.22 71.05,37.22 73,35.26
N$211
  Bottom 1.27: 70.53,35.95 71.1,35.95 72.83,34.23
N$212
  Bottom 1.27: 69.95,34.17 114.52,34.17 114.86,33.82
N$213
  Bottom 1.27: 70.93,34.69 70.93,34.92 70.64,35.2
N$215  (1 unrouted)
N$216
  Bottom 1.27: 10.13,32.78 10.52,32.78 26.3,17.01 61.08,17.01 63.95,19.87 63.95,24.79 64.05,24.89 64.05,25.1 63.64,25.51 63.64,25.61 64.46,26.43 104.16,26.43 105.08,25.51 105.08,12.9 107.84,10.14 107.84,6.55 109.79,4.61 109.79,-2.66 109.28,-3.18 0.61,-3.18 0.41,-3.38 0.41,27.86 | 0.41,27.86 0.41,32.58 1.23,33.4 | 13.4,14.24 13.4,14.87 0.41,27.86
N$217
  Bottom 1.27: 17.56,-0.61 103.26,-0.61 104.49,0.61 104.49,10.08 102.77,11.8 62.5,11.8 60.65,9.96 60.65,8.6 59.67,7.62 36.59,7.62 35.24,6.27 35.24,0.74 36.34,-0.37
N$218
  Bottom 1.27: 109.77,-1.97 109.4,-1.97 | 109.4,-1.97 0.12,-1.97 -0.74,-2.83 | 0.25,-1.11 106.94,-1.11 | 106.94,-1.11 108.54,-1.11 109.4,-1.97 | 106.94,-1.11 106.94,10.08 106.45,10.57
N$219
  Bottom 1.27: 108.54,-1.84 108.54,4.06 108.17,4.43
N$220
  Bottom 1.27: 107.68,-1.48 107.68,7.25 107.19,7.75
N$221
  Bottom 1.27: 105.84,-2.21 105.84,11.19 105.22,11.8
N$222
  Bottom 1.27: 104.24,-1.48 104.24,-0.37 105.72,1.11
N$223
  Bottom 1.27: 105.35,10.45 105.35,11.31 104.12,12.54
N$224
  Bottom 1.27: 104.86,10.2 104.86,11.68 104,12.54
N$225
  Bottom 1.27: 105.84,11.56 103.51,11.56 101.79,13.28
N$226
  Bottom 1.27: 104.49,12.91 62.25,12.91 59.92,10.57 59.92,8.73 59.43,8.24
N$227
  Bottom 1.27: 28.56,13.16 104.23,13.16 104.3,13.23 104.3,13.52 104.44,13.66 28.49,13.66 28.21,13.38 28.21,0.28 27.21,-0.71 27.64,-0.71 28.63,0.28 28.84,0.28 28.92,0.21 28.92,11.96 29.13,12.17 61.03,12.17 61.17,12.03 60.04,12.03 59.25,11.24 59.25,9.32 58.61,8.68 36.52,8.68 34.32,6.47 34.32,0.78 35.03,0.07
N$228
  Bottom 1.27: 34.03,-0.93 34.03,7.19 36.02,9.18 57.83,9.18 58.05,9.39
N$229
  Bottom 1.27: 58.9,10.03 36.17,10.03 33.18,7.04
N$230
  Bottom 1.27: 59.04,11.03 33.11,11.03 | 33.11,11.03 29.63,11.03 29.34,10.74 | 32.97,-0.21 32.97,10.89 33.11,11.03
N$231
  Bottom 1.27: 29.91,10.82 29.91,-1.99 30.69,-2.77
N$232
  Bottom 1.27: 31.05,10.53 31.05,0.43 31.62,-0.14
N$233
  Bottom 1.27: 31.83,10.89 31.83,1.14 32.97,0
N$234
  Bottom 1.27: 33.75,10.82 33.75,4.98 33.89,4.84
N$235
  Bottom 1.27: 35.59,11.1 35.59,10.88 34.03,9.32
N$236
  Bottom 1.27: 0.1,14.85 16.98,14.85 | 16.98,14.85 103.98,14.85 104.5,14.34 | 1.02,31.35 1.02,30.82 16.98,14.85
N$237
  Bottom 1.27: 102.26,14.09 102.47,14.09 104.32,15.94
N$238
  Bottom 1.27: 105.1,9.75 105.1,1 105.24,0.85
N$239
  Bottom 1.27: 104.82,-1.42 104.82,1.5 108.37,5.05 108.37,4.91 109.08,4.2
N$240
  Bottom 1.27: 24.15,-0.92 21.38,-0.92 | 21.38,-0.92 1.53,-0.92 1.23,-1.23 1.23,14.04 | 0.92,-0.2 20.67,-0.2 21.38,-0.92
N$241
  Bottom 1.27: 1.43,13.83 28.85,13.83 30.08,12.6
N$242
  Bottom 1.27: 28.44,11.88 2.35,11.88 1.94,11.47
N$243
  Bottom 1.27: 1.94,12.19 28.24,12.19 28.34,12.29
N$244
  Bottom 1.27: 27.93,12.6 1.23,12.6 0.92,12.29
N$245
  Bottom 1.27: 1.43,10.45 28.24,10.45 29.06,9.63
N$246
  Bottom 1.27: 28.34,10.65 2.76,10.65 2.66,10.76
N$247
  Bottom 1.27: 1.02,8.71 27.32,8.71
N$248
  Bottom 1.27: 27.52,9.53 2.15,9.53 1.84,9.84
N$249
  Bottom 1.27: 1.74,7.99 29.67,7.99 30.08,7.58
N$250
  Bottom 1.27: 29.16,6.86 1.13,6.86 1.02,6.76
N$251
  Bottom 1.27: 0.92,5.53 29.06,5.53 29.57,5.02
N$252
  Bottom 1.27: 28.96,4.2 1.13,4.2 0.82,4.51
N$253
  Bottom 1.27: 0.92,3.18 29.26,3.18 29.36,3.28
N$254
  Bottom 1.27: 28.96,1.95 0.92,1.95 0.72,2.15
N$255
  Bottom 1.27: 1.33,1.23 27.11,1.23 27.22,1.13
N$256
  Bottom 1.27: 27.73,0.61 0.72,0.61 0.51,0.41
N$257
  Bottom 1.27: 24.25,11.58 24.25,14.78 5.63,33.4
N$258
  Bottom 1.27: 22.41,14.24 22.41,14.88 2.56,34.73
N$259
  Bottom 1.27: 1.33,34.63 1.33,34.5 22.61,13.21
N$260
  Bottom 1.27: 21.18,13.52 21.18,13.55 0.82,33.91
N$261
  Bottom 1.27: 19.85,13.73 19.77,13.73 -0.92,34.42
N$262
  Bottom 1.27: 16.06,14.34 15.67,14.34 0.51,29.5
N$263
  Bottom 1.27: 12.59,14.34 12.39,14.34 0.61,26.12
N$264
  Bottom 1.27: 10.64,14.55 10.64,14.76 0.61,24.79
N$265
  Bottom 1.27: 9.93,14.75 8.71,14.75 0.61,22.84
N$266
  Bottom 1.27: 7.57,14.65 6.96,14.65 0.61,21
N$267
  Bottom 1.27: 5.22,14.24 5.22,15.27 1.33,19.16
N$268
  Bottom 1.27: 3.58,14.34 3.58,14.65 1.02,17.21
N$269
  Bottom 1.27: 1.84,14.96 1.84,15.57 1.33,16.08
N$270
  Bottom 1.27: 4.3,15.06 3.58,15.06 0.2,18.44
N$271
  Bottom 0.406: 44.69,57.52 45.52,57.52 45.64,57.41
N$272
  Bottom 0.406: 8.29,33.91 8.29,33.85 25.6,16.53 61.21,16.53 64.47,19.79 64.47,25.71 64.86,26.11
N$273
  Bottom 0.406: 11,34.01 11.14,34.01 27.03,18.11
N$274
  Bottom 0.406: 20.72,26.1 20.72,25.98 26.39,20.3 28.36,20.3 28.51,20.44
N$275
  Bottom 0.406: 13.67,34.66 13.67,34.51 27.45,20.73
N$276
  Bottom 0.406: 13.41,35.03 13.57,35.03 27.48,21.13
N$277
  Bottom 0.406: 0.53,23.82 0.53,23.81 8.94,15.4
N$278
  Bottom 0.406: 4.14,18.54 3.97,18.54 0.65,21.86
N$279
  Bottom 0.406: 3.79,38.74 3.79,54.8 3.26,55.33
N$280
  Bottom 0.406: 3.14,55.75 3.14,43.6 3.49,43.25
N$281
  Bottom 0.406: 0.85,18.61 1.02,18.61 4.52,15.11
N$282
  Bottom 0.406: 1.71,4.78 27.46,4.78 27.8,4.44
N$283
  Bottom 0.406: 59.96,14.14 60.77,14.14 65.38,18.76 65.38,24.09 66.1,24.8
N$284
  Bottom 1.422: 7.16,33.31 7.16,32.67 24.35,15.48 102.62,15.48 104.36,17.22 104.36,24.6 104.06,24.91 64.67,24.91 64.67,25.32 64.77,25.42 103.85,25.42 103.95,25.52 103.95,17.42 102.62,16.09 24.89,16.09 8.29,32.7
N$285
  Bottom 1.422: 25.68,18.55 103.24,18.55 103.34,18.65
N$286
  Bottom 1.422: 103.85,17.73 57.3,17.73 56.07,16.5
N$287
  Bottom 1.422: 60.06,17.94 101.6,17.94 102.62,16.91 57.5,16.91 57.4,16.81
N$288
  Bottom 1.422: 64.46,18.86 64.46,23.27 65.38,24.19
N$289
  Bottom 1.422: 65.59,23.78 102.83,23.78 103.14,23.47 103.03,23.47 103.03,21.11 | 103.03,21.11 103.03,19.06 102.62,18.65 | 64.77,21.93 102.21,21.93 103.03,21.11
N$290
  Bottom 1.422: 102.83,19.47 65.28,19.47 65.07,19.68
N$291
  Bottom 1.422: 65.18,20.4 102.32,20.4 102.73,19.99
N$292
  Bottom 1.422: 102.62,21.22 64.87,21.22 64.36,20.7
N$293
  Bottom 1.422: 102.73,23.06 66.41,23.06 65.89,22.55
N$294
  Bottom 1.422: 1.33,6.2 27.7,6.2 27.85,6.34
N$295
  Bottom 1.422: 21.49,29.79 21.49,29.78 27.8,23.47 49.46,23.47 50.49,24.5 50.49,25.69 45.88,30.3 33.01,30.3 32.32,29.62 21.66,29.62 21.38,29.89 33.96,29.89 34.46,29.4
N$296
  Bottom 1.422: 23.4,28.9 44.86,28.9 45.26,29.3
N$297
  Bottom 1.422: 45.31,29.12 45.45,29.12 49.22,25.36 49.22,24.67 49.05,24.5 27.77,24.5 24.4,27.87 45.37,27.87 45.49,27.75 47.77,25.47 28.11,25.47 26.59,26.98 45.63,26.98 46.17,26.44 45.63,26.44 45.43,26.24 28.96,26.24 28.65,26.55
N$298
  Bottom 0.406: 45.64,57.14 44.7,57.14 44.65,57.19 44.65,57.47 44.66,57.49 45.37,57.49 45.39,57.47
N$299
  Bottom 0.406: 47.52,57.41 48.06,57.41 48.08,57.39
N$300
  Bottom 0.406: 41.69,40.88 42.26,40.88 42.35,40.97
N$301
  Bottom 0.406: 41.61,40.45 41.76,40.45 41.97,40.23 42.16,40.23 42.33,40.4
N$302
  Bottom 0.406: 67.56,40.71 67.65,40.71 67.89,40.95 68.25,40.95 68.3,40.9 68.3,40.64 68.34,40.59 68.34,40.42 68.3,40.38 68.25,40.38 68.11,40.23 67.87,40.23 67.8,40.3 67.75,40.3 67.65,40.4 67.65,40.45 67.61,40.49 67.61,40.52 67.72,40.64 67.77,40.64 67.8,40.61 68.08,40.61 68.08,40.69 68.03,40.69 68.01,40.71
N$303
  Bottom 0.406: 14.7,41.95 14.7,35.88 16.43,34.15 17.51,34.15 18.1,34.75 18.1,42.4 17.32,43.19 17.32,43.14 16.82,42.64 15.31,42.64 14.71,42.05 14.71,36.15 16.49,34.37 17.39,34.37 17.86,34.85 17.86,42.58 17.25,43.19 17.06,43.19 16.61,42.74 17.37,42.74 17.52,42.59 17.52,34.81 17.32,34.62 16.53,34.62 14.93,36.22 14.93,41.93 15.36,42.36 16.91,42.36 17.06,42.51 17.17,42.51 17.22,42.46 17.22,35.04 16.99,34.81 16.74,34.81 15.22,36.33 15.22,41.77 15.59,42.13 16.96,42.13 16.99,42.1 16.99,35.13 16.89,35.03 16.89,35.06 15.49,36.46 15.49,41.8 15.59,41.9 16.68,41.9 16.76,41.81 16.76,35.44 16.63,35.31 16.63,35.39 16.54,35.47 16.54,41.77 16.49,41.81 16.39,41.81 16.39,35.75 16.2,35.56 16.2,41.6 16.11,41.68 | 16.11,41.68 | 16.11,41.68 16.1,41.7 16.1,36.37 15.8,36.07 15.8,36.78 15.82,36.8 15.82,41.75 15.85,41.78 15.6,41.78 15.54,41.72 15.54,37.19 16.02,36.71
VCC  (1 unrouted)
  Bottom 0.406: U1.2 12.45,58.17 11.43,57.15 11.43,50.8 U$1.E | 67.31,40.64 IC2.1 67.31,46.99 66.04,48.26 59.69,48.26 58.42,49.53 57.15,49.53 55.88,50.8 R1.P$1 | IC2.16 67.31,40.64 | 67.31,40.64 40.64,40.64 | 40.64,40.64 IC1.16 | 40.64,40.64 33.02,40.64 31.75,39.37 31.75,33.02 30.48,31.75 15.82,31.75 | 15.82,31.75 15.61,31.75 13.27,34.09 13.13,34.23 13.13,43.29 14.03,44.19 15.2,44.19 16.65,45.64 | 22.17,25.4 15.82,31.75
  Bottom 1.27: JP2.2 60.5,21.74 59.49,20.73 26.63,20.73 13.27,34.09
(copper drawn outside any net)
  shapes: Bottom circle x5

### Text on the board
Bottom: OPENHARDWARE.CO.ZA | I2C LCD Keypad for 3D Printers | GPL. 2012 | peter@itux.co.za